# EAGLE schematic drum machine (EAGLE 6.5.0)
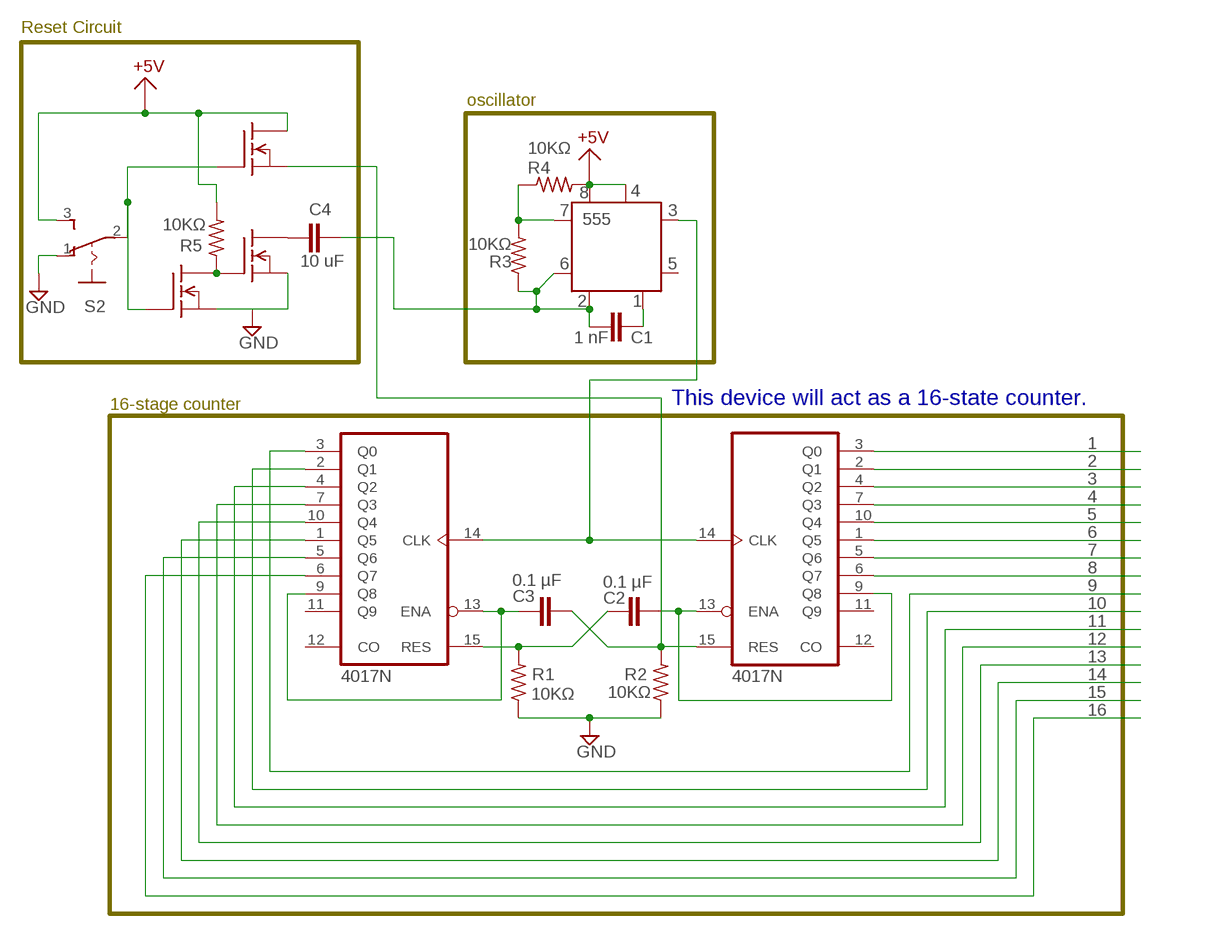
[diagram p0: schematic, sheet 1]

## Parts
C1  1 nF  C2.5/2  [C2.5-2]
C2  0.1 µF  C2.5/2  [C2.5-2]
C3  0.1 µF  C2.5/2  [C2.5-2]
C4  10 uF  C2.5/2  [C2.5-2]
IC1  4017N  [DIL16]
IC2  4017N  [DIL16]
Q1  BSS101  [TO92]
Q2  BSS101  [TO92]
Q3  BSS101  [TO92]
R1  10KΩ  R-US_0204/7  [0204/7]
R2  10KΩ  R-US_0204/7  [0204/7]
R3  10KΩ  R-US_0204/7  [0204/7]
R4  10KΩ  R-US_0204/7  [0204/7]
R5  10KΩ  R-US_0204/7  [0204/7]
S2  255SB  [255SB]
U$1  555  [555]
U$2  +5V  [+5V]
U$3  +5V  [+5V]

## Nets
GND: Q2.1(S) Q3.1(S) R1.1 R2.1 S2.1(O)
N$2: C3.1 IC2.9(Q8) IC2.13(ENA)
N$3: C2.2 IC1.9(Q8) IC1.13(ENA)
N$4: C3.2 IC1.15(RES) Q1.1(S) R2.2
N$5: IC2.15(RES) R1.2
N$6: C1.2 C4.1 R3.1 U$1.P$2 U$1.P$6
N$7: R4.2 U$1.P$4 U$1.P$8 U$2.P$1( )
N$8: C1.1 U$1.P$1
N$9: R3.2 R4.1 U$1.P$7
N$10: IC1.3(Q0)
N$11: IC1.2(Q1)
N$12: C2.1
N$13: IC1.4(Q2)
N$14: IC1.7(Q3)
N$15: IC1.10(Q4)
N$16: IC1.1(Q5)
N$17: IC1.5(Q6)
N$18: IC1.6(Q7)
N$19: IC2.3(Q0)
N$20: IC2.2(Q1)
N$21: IC2.4(Q2)
N$22: IC2.7(Q3)
N$23: IC2.10(Q4)
N$24: IC2.1(Q5)
N$25: IC2.5(Q6)
N$26: IC2.6(Q7)
N$27: IC1.14(CLK) IC2.14(CLK) U$1.P$3
N$28: Q2.3(D) Q3.2(G) R5.1
N$29: Q1.2(G) Q2.2(G) S2.2(P)
N$30: Q1.3(D) R5.2 S2.3(S) U$3.P$1( )
N$32: C4.2 Q3.3(D)
Unconnected: IC1.11(Q9) IC1.12(CO) IC2.11(Q9) IC2.12(CO) U$1.P$5

## Notes on the sheet
- Reset Circuit
- oscillator
- This device will act as a 16-state counter.
- 16-stage counter
- 1
- 2
- 3
- 4
- 5
- 6
- 7
- 8
- 9
- 10
- 11
- 12
- 13
- 14
- 15
- 16

## Power pins joined to a net without a drawn wire
VDD: IC1.16(VDD) IC2.16(VDD)
VSS: IC1.8(VSS) IC2.8(VSS)

## Library data of the parts
C1-C4 = capacitor-wima:C: CAPACITOR naming: grid - package width
IC1 IC2 = 40xx:4017: COUNTER/DIVIDER
Q1-Q3 = transistor-fet:BSS101: N-Channel Enhancement MOSFET 200V; 0,16A; 11Ohm
R1-R5 = rcl:R-US_: RESISTOR, American symbol
S2 = switch:255SB: SLIDING SWITCH Distributor Buerklin, 11G810
U$1 = 001.My.Stuff:555
U$2 U$3 = 001.My.Stuff:+5V